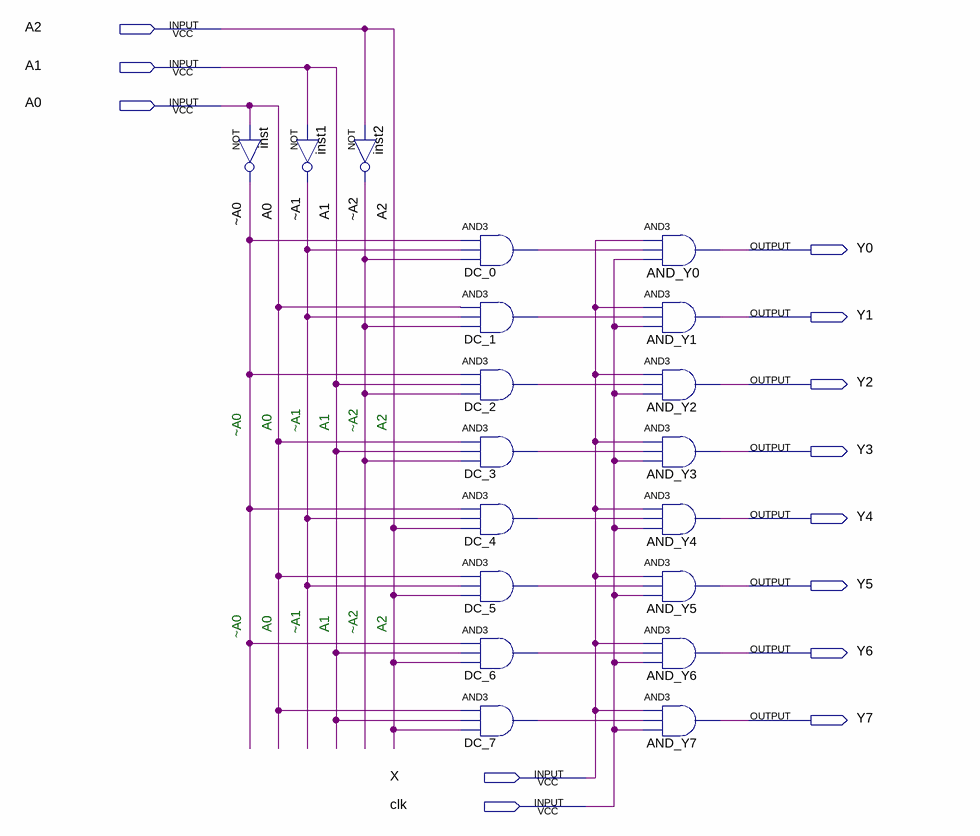
[diagram p0: schematic sheet]
// Quartus schematic SIFO_Lab_1.bdf as structural Verilog: 19 symbols, 13 pins
module SIFO_Lab_1 (
  input  A2,
  input  A1,
  input  A0,
  input  X,
  input  clk,
  output Y0,
  output Y1,
  output Y2,
  output Y3,
  output Y4,
  output Y5,
  output Y6,
  output Y7
);

  wire DC_0_out, DC_1_out, DC_2_out, DC_3_out, DC_4_out, DC_5_out, DC_6_out, DC_7_out, \~A0 , \~A1 , \~A2 ;

  not inst (\~A0 , A0);
  not inst1 (\~A1 , A1);
  not inst2 (\~A2 , A2);
  and DC_0 (DC_0_out, \~A0 , \~A1 , \~A2 );
  and DC_1 (DC_1_out, A0, \~A1 , \~A2 );
  and DC_2 (DC_2_out, \~A0 , A1, \~A2 );
  and DC_3 (DC_3_out, A0, A1, \~A2 );
  and DC_4 (DC_4_out, \~A0 , \~A1 , A2);
  and DC_5 (DC_5_out, A0, \~A1 , A2);
  and DC_6 (DC_6_out, \~A0 , A1, A2);
  and DC_7 (DC_7_out, A0, A1, A2);
  and AND_Y0 (Y0, X, DC_0_out, clk);
  and AND_Y1 (Y1, X, DC_1_out, clk);
  and AND_Y2 (Y2, X, DC_2_out, clk);
  and AND_Y3 (Y3, X, DC_3_out, clk);
  and AND_Y4 (Y4, X, DC_4_out, clk);
  and AND_Y5 (Y5, X, DC_5_out, clk);
  and AND_Y6 (Y6, X, DC_6_out, clk);
  and AND_Y7 (Y7, X, DC_7_out, clk);

  // Notes on the sheet:
  //   ~A1
  //   ~A2
  //   ~A0
  //   A0
  //   A1
  //   A2
  //   ~A1
  //   ~A2
  //   ~A0
  //   A0
  //   A1
  //   A2
endmodule
